# Altium schematic sheet PwrSupply.SchDoc
size A
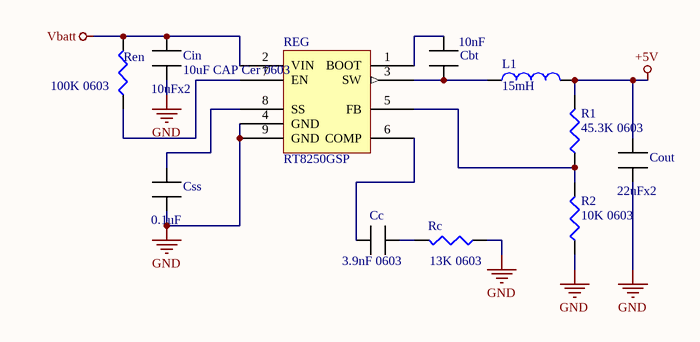
[diagram p0: PwrSupply.SchDoc]

## Parts
Cbt  value 10nF  [J1-0603]  (hidden comment: 10nF 0603)
Cc  3.9nF 0603  [J1-0603]
Cin  10uF CAP Cer 0603  value 10uFx2  [J1-0603]
Cout  value 22uFx2  [C0805]  (hidden comment: 22uF CAP CER 0805)
Css  value 0.1uF  [J1-0603]  (hidden comment: 0.1uF CAP CER 0603)
L1  value 15mH  [Inductor_Paw]
R1  45.3K 0603  [J1-0603]
R2  10K 0603  [J1-0603]
Rc  13K 0603  [J1-0603]
REG  RT8250GSP  [SOP-8-C_N]
Ren  100K 0603  [J1-0603]

## Nets
+5V: Cout.2(P2) L1.2 R1.2
GND: Cin.1(P1) Cout.1(P1) Css.1(P1) R2.1 Rc.1 REG.4(GND) REG.9(GND)
Vbatt: Cin.2(P2) REG.2(VIN) Ren.2
NetCbt_1: Cbt.1(P1) L1.1 REG.3(SW)
NetCbt_2: Cbt.2(P2) REG.1(BOOT)
NetCc_1: Cc.1(P1) REG.6(COMP)
NetCc_2: Cc.2(P2) Rc.2
NetCss_2: Css.2(P2) REG.8(SS)
NetR1_1: R1.1 R2.2 REG.5(FB)
NetREG_7: REG.7(EN) Ren.1

## Library data of the parts
Cbt Cc Cin Cout Css = CAP: Capacitor
  Cc: value: 3.9nF
L1 = Inductor: Code_IEC: 1005; Published: 8-Jun-2000; LatestRevisionDate: 17-Jul-2002; LatestRevisionNote: Re-released for DXP Platform.; PackageReference: 0402-A; Publisher: Altium Limited; Code_JEITA: 0402
R1 R2 Rc Ren = Res3: Resistor; Published: 8-Jun-2000; LatestRevisionDate: 04-Mar-2005; LatestRevisionNote: PCB Footprint replaced.; PackageReference: J1-0603; Publisher: Altium Limited
  R1: Value: 45.3K
  R2: Value: 10K
  Rc: Value: 13K
  Ren: Value: 100K
REG = RT8250GSP: 3A 5V Buck Regulator